# Altium schematic sheet 3v3_5v_SERIAL_CONVERTER_Schematic.SchDoc
size A
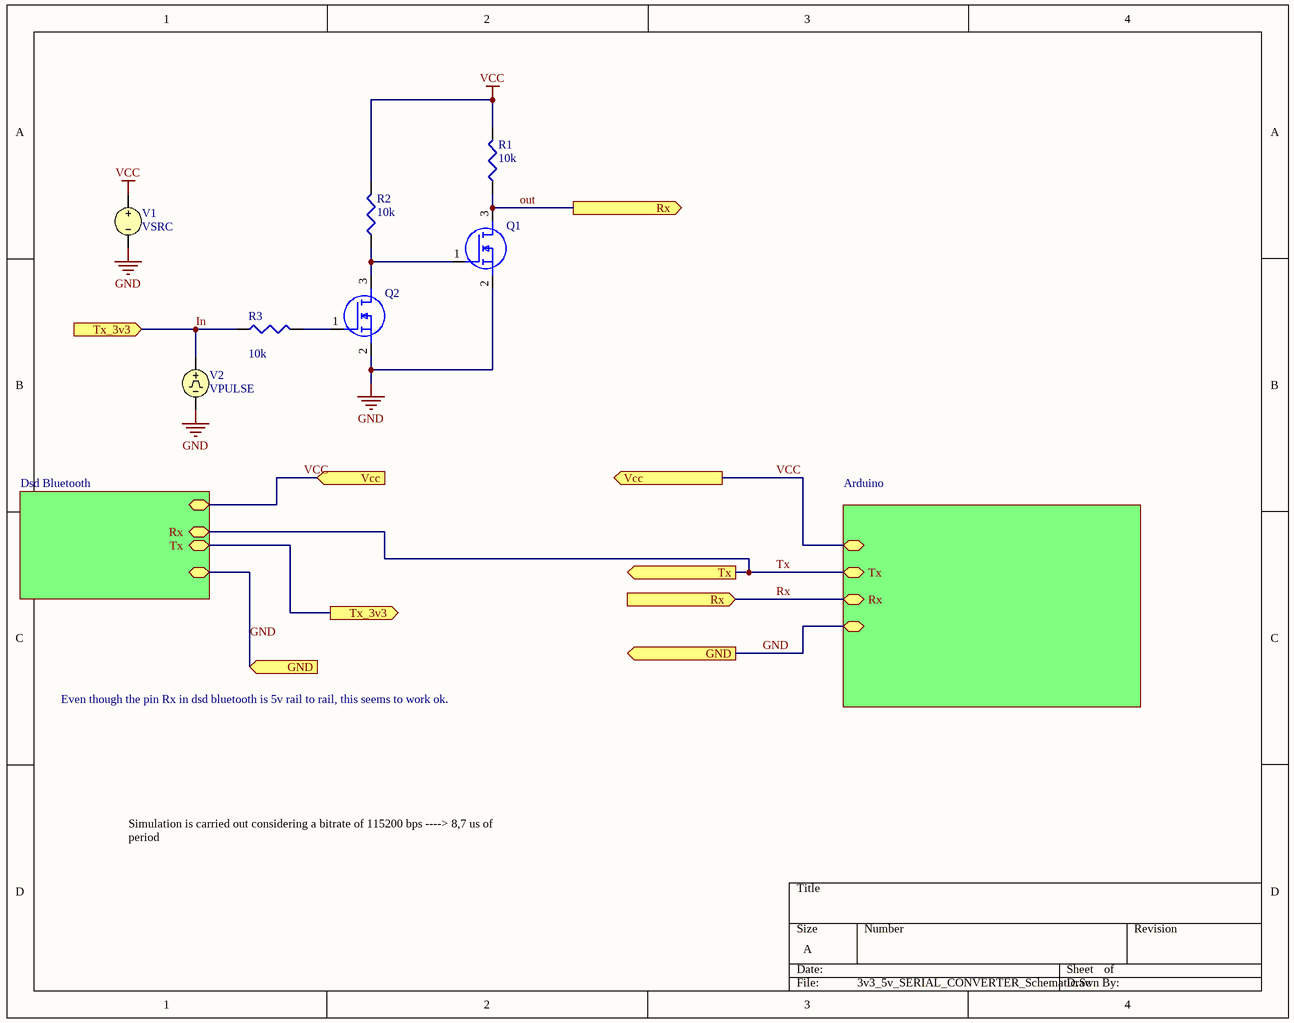
[diagram p0: 3v3_5v_SERIAL_CONVERTER_Schematic.SchDoc]

## Parts
Q1  BSS138LT1G  [SOT96P237X111-3N]  (value not drawn)
Q2  BSS138LT1G  [SOT96P237X111-3N]  (value not drawn)
R1  10k  [R0805]
R2  10k  [R0805]
R3  10k  [R0805]
V1  VSRC
V2  VPULSE

## Sub-sheets
Arduino = ?: , Tx, Rx, 
Dsd Bluetooth = ?: , Rx, Tx, 

## Ports
GND (in), GND (out), Rx (in), Rx (out), Tx (out), Tx_3v3 (in), Tx_3v3 (out), Vcc (in), Vcc (out)

## Nets
GND: Q1.2(S) Q2.2(S) V1.2 V2.2 ; port GND, sheet Arduino/, sheet Dsd Bluetooth/
VCC: R1.2 R2.2 V1.1 ; port Vcc, sheet Arduino/, sheet Dsd Bluetooth/
In: R3.1 V2.1 ; port Tx_3v3, sheet Dsd Bluetooth/Tx
out: Q1.3(D) R1.1 ; port Rx, sheet Arduino/Rx  [also labelled Rx]
Tx: port Tx, sheet Arduino/Tx, sheet Dsd Bluetooth/Rx
NetQ1_1: Q1.1(G) Q2.3(D) R2.1
NetQ2_1: Q2.1(G) R3.2

## Notes on the sheet
- Even though the pin Rx in dsd bluetooth is 5v rail to rail, this seems to work ok.
- Simulation is carried out considering a bitrate of 115200 bps ----> 8,7 us of period

## Library data of the parts
Q1 Q2 = BSS138LT1G: MOSFET (N-Channel); Manufacturer_Name: ON Semiconductor; Manufacturer: Boca Semiconductor; Datasheet Link: http://www.onsemi.com/pub/Collateral/BSS138LT1-D.PDF; Height: 1.11mm; Manufacturer_Part_Number: BSS138LT1G; Arrow Part Number: BSS138LT1G; Arrow Price/Stock: https://www.arrow.com/en/products/bss138lt1g/on-semiconductor; Mouser Part Number: 863-BSS138LT1G; Mouser Price/Stock: https://www.mouser.co.uk/ProductDetail/ON-Semiconductor/BSS138LT1G?qs=vNc2DXHODiKPZ2y3rQhTYQ%3D%3D; Supplier 1: Farnell; Manufacturer Part Number: BSS138LT1G; Stock 1: 418390; Pricing 1: 5=0.173, 25=0.12, 100=0.0679, 250=0.0567, 500=0.0454, 1000=0.0342, 5000=0.0284 (EUR); Supplier Part Number 1: 1431319
R1-R3 = RT0805FRE0710KL: Res Thin Film 0805 10K Ohm 1% 0.125W(1/8W) ±50ppm/C Epoxy Pad SMD T/R; Manufacturer: Yageo; Altezza custodia: 0.5 mm; Case Length: 2 mm; Case Width: 1.25 mm; Confezione: Reel; Resistenza: 10 kOhms; Package/involucro: 0805 (2012 metric); Potenza nominale: 125 mW (1/8 W); Serie: RT; Range di temperatura di lavoro: - 55 C to + 125 C; Stile di terminazione: SMD/SMT; Prodotto: Thin Film Resistors SMD; Tensione nominale: 150 V; Supplier 1: Farnell; Manufacturer Part Number: RT0805FRE0710KL; Stock 1: 1730; Pricing 1: 10=0.0973, 100=0.0584, 500=0.0332, 1000=0.026, 2500=0.0209, 5000=0.0176, 25000=0.013 (EUR); Case Code - in: 0805; Case Code - mm: 2012; Case Height: 0.5 mm; Coefficiente di temperatura: 50 PPM / C; Dimensioni: 1.25 mm W x 2 mm L x 0.5 mm H; Lunghezza custodia: 2 mm; Larghezza custodia: 1.25 mm; Dimensions: 1.25 mm W x 2 mm L x 0.5 mm H; Operating Temperature Range: - 55 C to + 125 C; Produttore: Yageo; RoHS:: Dettagli; RoHS: Details; Resistance: 10 kOhms; Power Rating: 125 mW (1/8 W); Package / Case: 0805 (2012 metric); Packaging: Reel; Product: Thin Film Resistors SMD; Series: RT; Tolleranza: 1 %; Termination Style: SMD/SMT; Tolerance: 1 %; Temperature Coefficient: 50 PPM / C; Voltage Rating: 150 V; Type: High Precision, High Stability; ComponentLink1URL: http://www.farnell.com/datasheets/2167391.pdf?src-supplier=Element14; ComponentLink1Description: http://www.farnell.com/datasheets/2167391.pdf?src-supplier=Element14; ComponentLink2URL: http://www.mouser.com/ds/2/447/yageodocoutput-1125656.pdf?src-supplier=Mouser; ComponentLink2Description: http://www.mouser.com/ds/2/447/yageodocoutput-1125656.pdf?src-supplier=Mouser; ComponentLink3URL: http://www.yageo.com/documents/recent/PYu-RT_1-to-0.01_RoHS_L_9.pdf?src-supplier=Digi-Key; ComponentLink3Description: http://www.yageo.com/documents/recent/PYu-RT_1-to-0.01_RoHS_L_9.pdf?src-supplier=Digi-Key; Supplier Part Number 1: 1500664; Value: 10k
V1 = VSRC: Voltage Source; Note: PCB Footprint - Not required; Value: 5V; Published: 8-Jun-2000; LatestRevisionDate: 17-Jul-2002; LatestRevisionNote: Re-released for DXP Platform.; PackageReference: Not Applicable; Publisher: Altium Limited
V2 = VPULSE: Pulse Voltage Source; Note: PCB Footprint - Not required; Published: 8-Jun-2000; LatestRevisionDate: 15-Nov-2004; LatestRevisionNote: Corrected Netlist.; PackageReference: Not Applicable; Publisher: Altium Limited